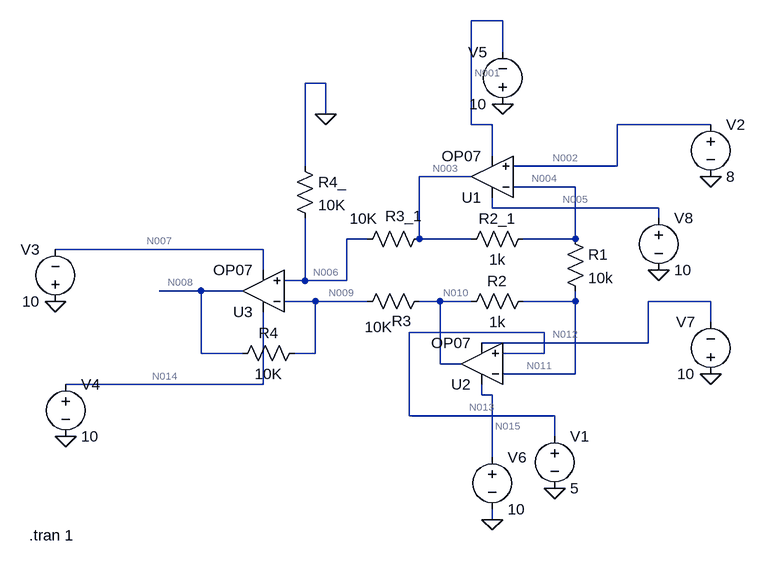
[diagram p0: schematic 1_3.asc]
1_3.asc, the LTspice schematic file:
Version 4
SHEET 1 880 680
WIRE 64 -208 16 -208
WIRE 64 -160 64 -208
WIRE -208 -112 -240 -112
WIRE -208 -64 -208 -112
WIRE 16 -48 16 -208
WIRE 48 -48 16 -48
WIRE 384 -48 240 -48
WIRE 48 0 48 -48
WIRE -240 16 -240 -112
WIRE 240 16 240 -48
WIRE 240 16 80 16
WIRE 16 32 -64 32
WIRE 176 48 80 48
WIRE 48 80 48 64
WIRE 304 80 48 80
WIRE 304 96 304 80
WIRE -144 128 -176 128
WIRE -64 128 -64 32
WIRE 16 128 -64 128
WIRE 176 128 176 48
WIRE 176 128 96 128
WIRE -304 144 -624 144
WIRE -304 176 -304 144
WIRE -240 192 -240 96
WIRE -240 192 -272 192
WIRE -176 192 -176 128
WIRE -176 192 -240 192
WIRE -400 208 -464 208
WIRE -336 208 -400 208
WIRE -224 224 -272 224
WIRE -144 224 -224 224
WIRE -32 224 -64 224
WIRE 16 224 -32 224
WIRE 176 224 176 208
WIRE 176 224 96 224
WIRE 384 224 288 224
WIRE 384 256 384 224
WIRE 128 272 -80 272
WIRE 288 288 288 224
WIRE 288 288 32 288
WIRE -400 304 -400 208
WIRE -336 304 -400 304
WIRE -224 304 -224 224
WIRE -224 304 -256 304
WIRE 128 304 128 272
WIRE 128 304 64 304
WIRE -32 320 -32 224
WIRE 0 320 -32 320
WIRE 176 336 176 224
WIRE 176 336 64 336
WIRE -304 352 -304 240
WIRE -304 352 -608 352
WIRE 32 368 32 352
WIRE 48 368 32 368
WIRE -80 400 -80 272
WIRE 144 400 -80 400
WIRE 144 432 144 400
WIRE 48 464 48 368
WIRE 48 560 48 544
FLAG 384 32 0
FLAG 144 512 0
FLAG -624 224 0
FLAG -608 432 0
FLAG 48 560 0
FLAG 384 336 0
FLAG 64 -80 0
FLAG 304 176 0
FLAG -208 -64 0
SYMBOL OpAmps\\OP07 48 96 R180
SYMATTR InstName U1
SYMBOL OpAmps\\OP07 32 384 R180
SYMATTR InstName U2
SYMBOL OpAmps\\OP07 -304 272 R180
SYMATTR InstName U3
SYMBOL res 112 112 R90
WINDOW 0 0 56 VBottom 2
WINDOW 3 32 56 VTop 2
SYMATTR InstName R2_1
SYMATTR Value 1k
SYMBOL res 112 208 R90
WINDOW 0 0 56 VBottom 2
WINDOW 3 32 56 VTop 2
SYMATTR InstName R2
SYMATTR Value 1k
SYMBOL res 160 112 R0
SYMATTR InstName R1
SYMATTR Value 10k
SYMBOL res -160 144 R270
WINDOW 0 36 72 VTop 2
WINDOW 3 63 10 VBottom 2
SYMATTR InstName R3_1
SYMATTR Value 10K
SYMBOL res -160 240 R270
WINDOW 0 -30 69 VTop 2
WINDOW 3 -8 33 VBottom 2
SYMATTR InstName R3
SYMATTR Value 10K
SYMBOL voltage 144 416 R0
SYMATTR InstName V1
SYMATTR Value 5
SYMBOL voltage 384 -64 R0
SYMATTR InstName V2
SYMATTR Value 8
SYMBOL voltage -624 240 R180
WINDOW 0 24 96 Left 2
WINDOW 3 24 16 Left 2
SYMATTR InstName V3
SYMATTR Value 10
SYMBOL voltage -608 336 R0
SYMATTR InstName V4
SYMATTR Value 10
SYMBOL voltage 64 -64 R180
WINDOW 0 24 96 Left 2
WINDOW 3 24 16 Left 2
SYMATTR InstName V5
SYMATTR Value 10
SYMBOL voltage 48 448 R0
SYMATTR InstName V6
SYMATTR Value 10
SYMBOL voltage 384 352 R180
WINDOW 0 24 96 Left 2
WINDOW 3 24 16 Left 2
SYMATTR InstName V7
SYMATTR Value 10
SYMBOL voltage 304 80 R0
SYMATTR InstName V8
SYMATTR Value 10
SYMBOL res -352 320 R270
WINDOW 0 32 56 VTop 2
WINDOW 3 0 56 VBottom 2
SYMATTR InstName R4
SYMATTR Value 10K
SYMBOL res -256 0 R0
SYMATTR InstName R4_
SYMATTR Value 10K
TEXT -664 584 Left 2 !.tran 1

The netlist it stands for:
* 1_3.asc
XU1 N002 N004 N005 N001 N003 LT1001  ; OP07, pins In+ In- V+ V- OUT
XU2 N013 N011 N015 N012 N010 LT1001  ; OP07, pins In+ In- V+ V- OUT
XU3 N006 N009 N014 N007 N008 LT1001  ; OP07, pins In+ In- V+ V- OUT
R2_1 N004 N003 1k
R2 N011 N010 1k
R1 N004 N011 10k
R3_1 N006 N003 10K
R3 N009 N010 10K
V1 N013 0 5
V2 N002 0 8
V3 0 N007 10
V4 N014 0 10
V5 0 N001 10
V6 N015 0 10
V7 0 N012 10
V8 N005 0 10
R4 N008 N009 10K
R4_ 0 N006 10K
.tran 1
.lib LTC.lib
.backanno
.end

* Results of the author's LTspice run, read from the files saved beside the schematic
* Operating Point, zero values left out:
*   V(n004) = 8 V
*   V(n002) = 8 V
*   V(n005) = 10 V
*   V(n001) = -10 V
*   V(n003) = 8.3 V
*   V(n011) = 5 V
*   V(n013) = 5 V
*   V(n015) = 10 V
*   V(n012) = -10 V
*   V(n010) = 4.7 V
*   V(n009) = 4.15 V
*   V(n006) = 4.15 V
*   V(n014) = 10 V
*   V(n007) = -10 V
*   V(n008) = 3.6 V
*   I(R2_1) = -300 µA
*   I(R2) = 300 µA
*   I(R1) = 300 µA
*   I(R3_1) = -415 µA
*   I(R3) = -55 µA
*   I(R4) = -55 µA
*   I(R4_) = -415 µA
*   I(V1) = -9.013 pA
*   I(V2) = -14.44 pA
*   I(V3) = -2.278 mA
*   I(V4) = -2.223 mA
*   I(V5) = -1.907 mA
*   I(V6) = -2.129 mA
*   I(V7) = -2.374 mA
*   I(V8) = -2.622 mA
*   Ix(u1:1) = 14.44 pA
*   Ix(u1:2) = 14.14 pA
*   Ix(u1:3) = 2.622 mA
*   Ix(u1:4) = -1.907 mA
*   Ix(u1:5) = -715 µA
*   Ix(u2:1) = 9.013 pA
*   Ix(u2:2) = 8.844 pA
*   Ix(u2:3) = 2.129 mA
*   Ix(u2:4) = -2.374 mA
*   Ix(u2:5) = 245 µA
*   Ix(u3:1) = 7.476 pA
*   Ix(u3:2) = 7.346 pA
*   Ix(u3:3) = 2.223 mA
*   Ix(u3:4) = -2.278 mA
*   Ix(u3:5) = 55 µA